# Altium schematic sheet Buck.SchDoc
size A; SheetNumber: 2; SheetTotal: 4
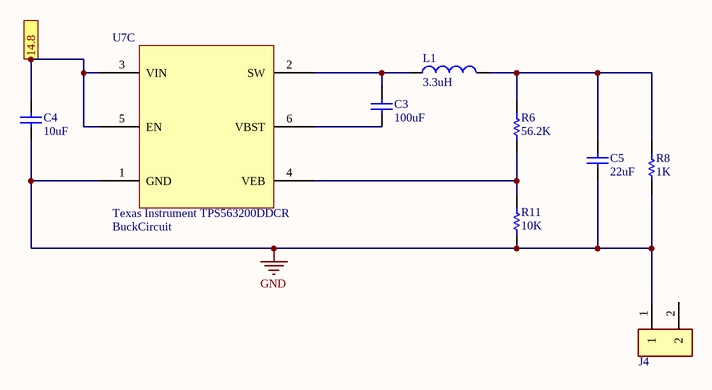
[diagram p0: Buck.SchDoc]

## Parts
C3  value 100uF  [0805]  (hidden comment: Capacitor)
C4  value 10uF  [0805]  (hidden comment: Capacitor)
C5  value 22uF  [0805]  (hidden comment: Capacitor)
J4  1935161  [PHOENIX_1935161]  (value not drawn)
L1  value 3.3uH  [0805]  (hidden comment: Inductor)
R6  value 56.2K  [0805]  (hidden comment: Resistor)
R8  value 1K  [0805]  (hidden comment: Resistor)
R11  value 10K  [0805]  (hidden comment: Resistor)
U7  BuckCircuit  [SOT95P280X110-6N]  (part C of 3)

## Ports
14.8 (see BMS_MAIN[7B], Differential_Amp[2A])

## Nets
GND: C4.1 C5.1 J4.1 R8.1 R11.1 U7.1(GND)
14.8: C4.2 U7.3(VIN) U7.5(EN) ; port 14.8
NetC3_1: C3.1 U7.6(VBST)
NetC3_2: C3.2 L1.1 U7.2(SW)
NetC5_2: C5.2 L1.2 R6.2 R8.2
NetR6_1: R6.1 R11.2 U7.4(VEB)

Not connected (* = marked no-connect by the designer): J4 2

## Notes on the sheet
- (in symbol BuckCircuit, part C) Texas Instrument TPS563200DDCR

## Library data of the parts
C3-C5 = Capacitor: SimulationGenericComponent: True
J4 = 1935161: Conn Terminal Blocks 2 POS 5mm Solder ST Thru-Hole 16A; MF: {'manufacturer': u'Phoenix Contact'}; Package: None; MP: 1935161; Value: *; Price: None; Availability: Unavailable
L1 = Inductor: SimulationGenericComponent: True
R6 R8 R11 = Resistor: TC1: 0; SimulationGenericComponent: True; TC2: 0